# Altium schematic sheet Sch1.SchDoc
size A4; SheetNumber: 4; SheetTotal: 6
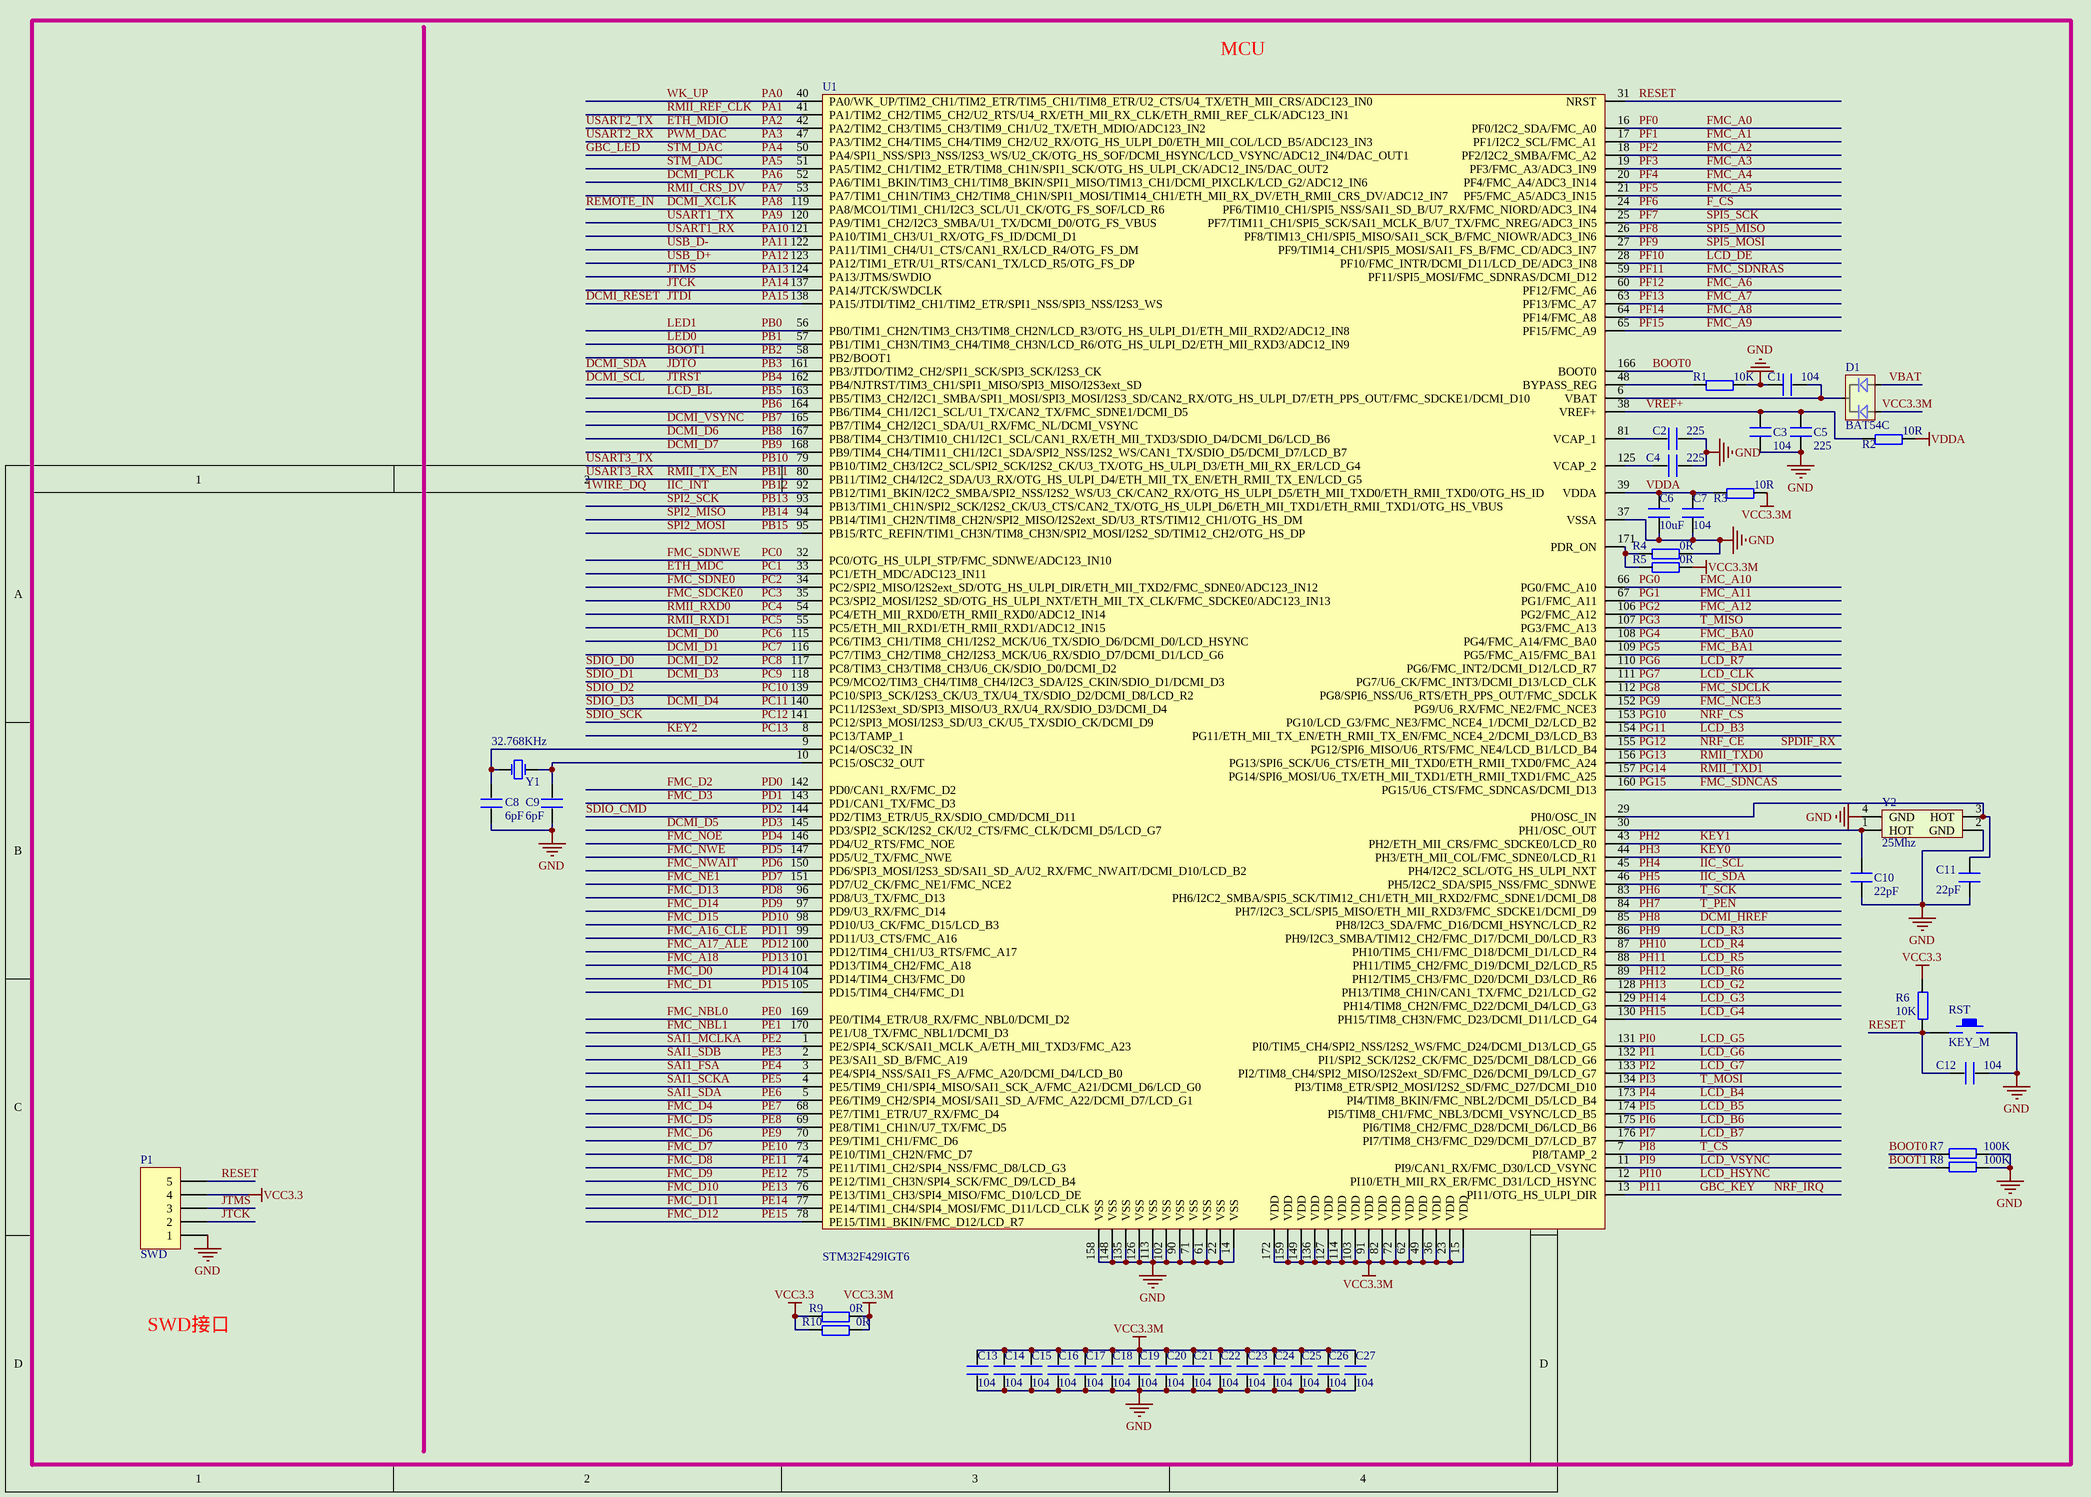
[diagram p0: Sch1.SchDoc]

## Parts
C1  104  [0402]
C2  225  [0402]
C3  104  [0402]
C4  225  [0402]
C5  225  [0402]
C6  10uF  [0603P]
C7  104  [0402]
C8  6pF  [0402]
C9  6pF  [0402]
C10  22pF  [0402]
C11  22pF  [0402]
C12  104  [0402]
C13  104  [0402]
C14  104  [0402]
C15  104  [0402]
C16  104  [0402]
C17  104  [0402]
C18  104  [0402]
C19  104  [0402]
C20  104  [0402]
C21  104  [0402]
C22  104  [0402]
C23  104  [0402]
C24  104  [0402]
C25  104  [0402]
C26  104  [0402]
C27  104  [0402]
D1  BAT54C  [SOT-23]
P1  SWD  [HDR1X5]
R1  10K  [0402]
R2  10R  [0402]
R3  10R  [0402]
R4  0R  [0402]
R5  0R  [0402]
R6  10K  [0402]
R7  100K  [0402]
R8  100K  [0402]
R9  0R  [0402]
R10  0R  [0402]
RST  KEY_M  [KEY_SOP3625]
U1  STM32F429IGT6  [LQFP176]
Y1  32.768KHz  [XTAL3215]
Y2  25Mhz  [XTAL3225]

## Nets
GND: C1.1 C2.2 C3.1 C4.1 C5.1 C6.1 C7.1 C8.1 C9.1 C10.1 C11.1 C12.2 C13.1 C14.1 C15.1 C16.1 C17.1 C18.1 C19.1 C20.1 C21.1 C22.1 C23.1 C24.1 C25.1 C26.1 C27.1 P1.1 R1.2 R4.2 R7.1 R8.1 RST.2 U1.14(VSS) U1.22(VSS) U1.37(VSSA) U1.61(VSS) U1.71(VSS) U1.90(VSS) U1.102(VSS) U1.113(VSS) U1.126(VSS) U1.135(VSS) U1.148(VSS) U1.158(VSS) Y2.2(GND) Y2.4(GND)
VCC3.3: P1.4 R6.2 R9.1 R10.1
VCC3.3M: C13.2 C14.2 C15.2 C16.2 C17.2 C18.2 C19.2 C20.2 C21.2 C22.2 C23.2 C24.2 C25.2 C26.2 C27.2 D1.1 R3.2 R5.2 R9.2 R10.2 U1.15(VDD) U1.23(VDD) U1.36(VDD) U1.49(VDD) U1.62(VDD) U1.72(VDD) U1.82(VDD) U1.91(VDD) U1.103(VDD) U1.114(VDD) U1.127(VDD) U1.136(VDD) U1.149(VDD) U1.159(VDD) U1.172(VDD)
VDDA: C6.2 C7.2 R2.2 R3.1 U1.39(VDDA)
1WIRE_DQ: U1.92(PB12/TIM1_BKIN/I2C2_SMBA/SPI2_NSS/I2S2_WS/U3_CK/CAN2_RX/OTG_HS_ULPI_D5/ETH_MII_TXD0/ETH_RMII_TXD0/OTG_HS_ID)  [also labelled IIC_INT, PB12]
BOOT0: R7.2 U1.166(BOOT0)
BOOT1: R8.2 U1.58(PB2/BOOT1)  [also labelled PB2]
DCMI_D0: U1.115(PC6/TIM3_CH1/TIM8_CH1/I2S2_MCK/U6_TX/SDIO_D6/DCMI_D0/LCD_HSYNC)  [also labelled PC6]
DCMI_D1: U1.116(PC7/TIM3_CH2/TIM8_CH2/I2S3_MCK/U6_RX/SDIO_D7/DCMI_D1/LCD_G6)  [also labelled PC7]
DCMI_D2: U1.117(PC8/TIM3_CH3/TIM8_CH3/U6_CK/SDIO_D0/DCMI_D2)  [also labelled PC8, SDIO_D0]
DCMI_D3: U1.118(PC9/MCO2/TIM3_CH4/TIM8_CH4/I2C3_SDA/I2S_CKIN/SDIO_D1/DCMI_D3)  [also labelled PC9, SDIO_D1]
DCMI_D4: U1.140(PC11/I2S3ext_SD/SPI3_MISO/U3_RX/U4_RX/SDIO_D3/DCMI_D4)  [also labelled PC11, SDIO_D3]
DCMI_D5: U1.145(PD3/SPI2_SCK/I2S2_CK/U2_CTS/FMC_CLK/DCMI_D5/LCD_G7)  [also labelled PD3]
DCMI_D6: U1.167(PB8/TIM4_CH3/TIM10_CH1/I2C1_SCL/CAN1_RX/ETH_MII_TXD3/SDIO_D4/DCMI_D6/LCD_B6)  [also labelled PB8]
DCMI_D7: U1.168(PB9/TIM4_CH4/TIM11_CH1/I2C1_SDA/SPI2_NSS/I2S2_WS/CAN1_TX/SDIO_D5/DCMI_D7/LCD_B7)  [also labelled PB9]
DCMI_HREF: U1.85(PH8/I2C3_SDA/FMC_D16/DCMI_HSYNC/LCD_R2)  [also labelled PH8]
DCMI_PCLK: U1.52(PA6/TIM1_BKIN/TIM3_CH1/TIM8_BKIN/SPI1_MISO/TIM13_CH1/DCMI_PIXCLK/LCD_G2/ADC12_IN6)  [also labelled PA6]
DCMI_RESET: U1.138(PA15/JTDI/TIM2_CH1/TIM2_ETR/SPI1_NSS/SPI3_NSS/I2S3_WS)  [also labelled JTDI, PA15]
DCMI_SCL: U1.162(PB4/NJTRST/TIM3_CH1/SPI1_MISO/SPI3_MISO/I2S3ext_SD)  [also labelled JTRST, PB4]
DCMI_SDA: U1.161(PB3/JTDO/TIM2_CH2/SPI1_SCK/SPI3_SCK/I2S3_CK)  [also labelled JDTO, PB3]
DCMI_VSYNC: U1.165(PB7/TIM4_CH2/I2C1_SDA/U1_RX/FMC_NL/DCMI_VSYNC)  [also labelled PB7]
DCMI_XCLK: U1.119(PA8/MCO1/TIM1_CH1/I2C3_SCL/U1_CK/OTG_FS_SOF/LCD_R6)  [also labelled PA8, REMOTE_IN]
ETH_MDC: U1.33(PC1/ETH_MDC/ADC123_IN11)  [also labelled PC1]
ETH_MDIO: U1.42(PA2/TIM2_CH3/TIM5_CH3/TIM9_CH1/U2_TX/ETH_MDIO/ADC123_IN2)  [also labelled PA2, USART2_TX]
F_CS: U1.24(PF6/TIM10_CH1/SPI5_NSS/SAI1_SD_B/U7_RX/FMC_NIORD/ADC3_IN4)  [also labelled PF6]
FMC_A0: U1.16(PF0/I2C2_SDA/FMC_A0)  [also labelled PF0]
FMC_A1: U1.17(PF1/I2C2_SCL/FMC_A1)  [also labelled PF1]
FMC_A2: U1.18(PF2/I2C2_SMBA/FMC_A2)  [also labelled PF2]
FMC_A3: U1.19(PF3/FMC_A3/ADC3_IN9)  [also labelled PF3]
FMC_A4: U1.20(PF4/FMC_A4/ADC3_IN14)  [also labelled PF4]
FMC_A5: U1.21(PF5/FMC_A5/ADC3_IN15)  [also labelled PF5]
FMC_A6: U1.60(PF12/FMC_A6)  [also labelled PF12]
FMC_A7: U1.63(PF13/FMC_A7)  [also labelled PF13]
FMC_A8: U1.64(PF14/FMC_A8)  [also labelled PF14]
FMC_A9: U1.65(PF15/FMC_A9)  [also labelled PF15]
FMC_A10: U1.66(PG0/FMC_A10)  [also labelled PG0]
FMC_A11: U1.67(PG1/FMC_A11)  [also labelled PG1]
FMC_A12: U1.106(PG2/FMC_A12)  [also labelled PG2]
FMC_A16_CLE: U1.99(PD11/U3_CTS/FMC_A16)  [also labelled PD11]
FMC_A17_ALE: U1.100(PD12/TIM4_CH1/U3_RTS/FMC_A17)  [also labelled PD12]
FMC_A18: U1.101(PD13/TIM4_CH2/FMC_A18)  [also labelled PD13]
FMC_BA0: U1.108(PG4/FMC_A14/FMC_BA0)  [also labelled PG4]
FMC_BA1: U1.109(PG5/FMC_A15/FMC_BA1)  [also labelled PG5]
FMC_D0: U1.104(PD14/TIM4_CH3/FMC_D0)  [also labelled PD14]
FMC_D1: U1.105(PD15/TIM4_CH4/FMC_D1)  [also labelled PD15]
FMC_D2: U1.142(PD0/CAN1_RX/FMC_D2)  [also labelled PD0]
FMC_D3: U1.143(PD1/CAN1_TX/FMC_D3)  [also labelled PD1]
FMC_D4: U1.68(PE7/TIM1_ETR/U7_RX/FMC_D4)  [also labelled PE7]
FMC_D5: U1.69(PE8/TIM1_CH1N/U7_TX/FMC_D5)  [also labelled PE8]
FMC_D6: U1.70(PE9/TIM1_CH1/FMC_D6)  [also labelled PE9]
FMC_D7: U1.73(PE10/TIM1_CH2N/FMC_D7)  [also labelled PE10]
FMC_D8: U1.74(PE11/TIM1_CH2/SPI4_NSS/FMC_D8/LCD_G3)  [also labelled PE11]
FMC_D9: U1.75(PE12/TIM1_CH3N/SPI4_SCK/FMC_D9/LCD_B4)  [also labelled PE12]
FMC_D10: U1.76(PE13/TIM1_CH3/SPI4_MISO/FMC_D10/LCD_DE)  [also labelled PE13]
FMC_D11: U1.77(PE14/TIM1_CH4/SPI4_MOSI/FMC_D11/LCD_CLK)  [also labelled PE14]
FMC_D12: U1.78(PE15/TIM1_BKIN/FMC_D12/LCD_R7)  [also labelled PE15]
FMC_D13: U1.96(PD8/U3_TX/FMC_D13)  [also labelled PD8]
FMC_D14: U1.97(PD9/U3_RX/FMC_D14)  [also labelled PD9]
FMC_D15: U1.98(PD10/U3_CK/FMC_D15/LCD_B3)  [also labelled PD10]
FMC_NBL0: U1.169(PE0/TIM4_ETR/U8_RX/FMC_NBL0/DCMI_D2)  [also labelled PE0]
FMC_NBL1: U1.170(PE1/U8_TX/FMC_NBL1/DCMI_D3)  [also labelled PE1]
FMC_NCE3: U1.152(PG9/U6_RX/FMC_NE2/FMC_NCE3)  [also labelled PG9]
FMC_NE1: U1.151(PD7/U2_CK/FMC_NE1/FMC_NCE2)  [also labelled PD7]
FMC_NOE: U1.146(PD4/U2_RTS/FMC_NOE)  [also labelled PD4]
FMC_NWAIT: U1.150(PD6/SPI3_MOSI/I2S3_SD/SAI1_SD_A/U2_RX/FMC_NWAIT/DCMI_D10/LCD_B2)  [also labelled PD6]
FMC_NWE: U1.147(PD5/U2_TX/FMC_NWE)  [also labelled PD5]
FMC_SDCKE0: U1.35(PC3/SPI2_MOSI/I2S2_SD/OTG_HS_ULPI_NXT/ETH_MII_TX_CLK/FMC_SDCKE0/ADC123_IN13)  [also labelled PC3]
FMC_SDCLK: U1.112(PG8/SPI6_NSS/U6_RTS/ETH_PPS_OUT/FMC_SDCLK)  [also labelled PG8]
FMC_SDNCAS: U1.160(PG15/U6_CTS/FMC_SDNCAS/DCMI_D13)  [also labelled PG15]
FMC_SDNE0: U1.34(PC2/SPI2_MISO/I2S2ext_SD/OTG_HS_ULPI_DIR/ETH_MII_TXD2/FMC_SDNE0/ADC123_IN12)  [also labelled PC2]
FMC_SDNRAS: U1.59(PF11/SPI5_MOSI/FMC_SDNRAS/DCMI_D12)  [also labelled PF11]
FMC_SDNWE: U1.32(PC0/OTG_HS_ULPI_STP/FMC_SDNWE/ADC123_IN10)  [also labelled PC0]
GBC_KEY: U1.13(PI11/OTG_HS_ULPI_DIR)  [also labelled NRF_IRQ, PI11]
GBC_LED: U1.50(PA4/SPI1_NSS/SPI3_NSS/I2S3_WS/U2_CK/OTG_HS_SOF/DCMI_HSYNC/LCD_VSYNC/ADC12_IN4/DAC_OUT1)  [also labelled PA4, STM_DAC]
IIC_SCL: U1.45(PH4/I2C2_SCL/OTG_HS_ULPI_NXT)  [also labelled PH4]
IIC_SDA: U1.46(PH5/I2C2_SDA/SPI5_NSS/FMC_SDNWE)  [also labelled PH5]
JTCK: P1.2 U1.137(PA14/JTCK/SWDCLK)  [also labelled PA14]
JTMS: P1.3 U1.124(PA13/JTMS/SWDIO)  [also labelled PA13]
KEY0: U1.44(PH3/ETH_MII_COL/FMC_SDNE0/LCD_R1)  [also labelled PH3]
KEY1: U1.43(PH2/ETH_MII_CRS/FMC_SDCKE0/LCD_R0)  [also labelled PH2]
KEY2: U1.8(PC13/TAMP_1)  [also labelled PC13]
LCD_B3: U1.154(PG11/ETH_MII_TX_EN/ETH_RMII_TX_EN/FMC_NCE4_2/DCMI_D3/LCD_B3)  [also labelled PG11]
LCD_B4: U1.173(PI4/TIM8_BKIN/FMC_NBL2/DCMI_D5/LCD_B4)  [also labelled PI4]
LCD_B5: U1.174(PI5/TIM8_CH1/FMC_NBL3/DCMI_VSYNC/LCD_B5)  [also labelled PI5]
LCD_B6: U1.175(PI6/TIM8_CH2/FMC_D28/DCMI_D6/LCD_B6)  [also labelled PI6]
LCD_B7: U1.176(PI7/TIM8_CH3/FMC_D29/DCMI_D7/LCD_B7)  [also labelled PI7]
LCD_BL: U1.163(PB5/TIM3_CH2/I2C1_SMBA/SPI1_MOSI/SPI3_MOSI/I2S3_SD/CAN2_RX/OTG_HS_ULPI_D7/ETH_PPS_OUT/FMC_SDCKE1/DCMI_D10)  [also labelled PB5]
LCD_CLK: U1.111(PG7/U6_CK/FMC_INT3/DCMI_D13/LCD_CLK)  [also labelled PG7]
LCD_DE: U1.28(PF10/FMC_INTR/DCMI_D11/LCD_DE/ADC3_IN8)  [also labelled PF10]
LCD_G2: U1.128(PH13/TIM8_CH1N/CAN1_TX/FMC_D21/LCD_G2)  [also labelled PH13]
LCD_G3: U1.129(PH14/TIM8_CH2N/FMC_D22/DCMI_D4/LCD_G3)  [also labelled PH14]
LCD_G4: U1.130(PH15/TIM8_CH3N/FMC_D23/DCMI_D11/LCD_G4)  [also labelled PH15]
LCD_G5: U1.131(PI0/TIM5_CH4/SPI2_NSS/I2S2_WS/FMC_D24/DCMI_D13/LCD_G5)  [also labelled PI0]
LCD_G6: U1.132(PI1/SPI2_SCK/I2S2_CK/FMC_D25/DCMI_D8/LCD_G6)  [also labelled PI1]
LCD_G7: U1.133(PI2/TIM8_CH4/SPI2_MISO/I2S2ext_SD/FMC_D26/DCMI_D9/LCD_G7)  [also labelled PI2]
LCD_HSYNC: U1.12(PI10/ETH_MII_RX_ER/FMC_D31/LCD_HSYNC)  [also labelled PI10]
LCD_R3: U1.86(PH9/I2C3_SMBA/TIM12_CH2/FMC_D17/DCMI_D0/LCD_R3)  [also labelled PH9]
LCD_R4: U1.87(PH10/TIM5_CH1/FMC_D18/DCMI_D1/LCD_R4)  [also labelled PH10]
LCD_R5: U1.88(PH11/TIM5_CH2/FMC_D19/DCMI_D2/LCD_R5)  [also labelled PH11]
LCD_R6: U1.89(PH12/TIM5_CH3/FMC_D20/DCMI_D3/LCD_R6)  [also labelled PH12]
LCD_R7: U1.110(PG6/FMC_INT2/DCMI_D12/LCD_R7)  [also labelled PG6]
LCD_VSYNC: U1.11(PI9/CAN1_RX/FMC_D30/LCD_VSYNC)  [also labelled PI9]
LED0: U1.57(PB1/TIM1_CH3N/TIM3_CH4/TIM8_CH3N/LCD_R6/OTG_HS_ULPI_D2/ETH_MII_RXD3/ADC12_IN9)  [also labelled PB1]
LED1: U1.56(PB0/TIM1_CH2N/TIM3_CH3/TIM8_CH2N/LCD_R3/OTG_HS_ULPI_D1/ETH_MII_RXD2/ADC12_IN8)  [also labelled PB0]
NRF_CE: U1.155(PG12/SPI6_MISO/U6_RTS/FMC_NE4/LCD_B1/LCD_B4)  [also labelled PG12, SPDIF_RX]
NRF_CS: U1.153(PG10/LCD_G3/FMC_NE3/FMC_NCE4_1/DCMI_D2/LCD_B2)  [also labelled PG10]
PA0: U1.40(PA0/WK_UP/TIM2_CH1/TIM2_ETR/TIM5_CH1/TIM8_ETR/U2_CTS/U4_TX/ETH_MII_CRS/ADC123_IN0)  [also labelled WK_UP]
PA1: U1.41(PA1/TIM2_CH2/TIM5_CH2/U2_RTS/U4_RX/ETH_MII_RX_CLK/ETH_RMII_REF_CLK/ADC123_IN1)  [also labelled RMII_REF_CLK]
PA3: U1.47(PA3/TIM2_CH4/TIM5_CH4/TIM9_CH2/U2_RX/OTG_HS_ULPI_D0/ETH_MII_COL/LCD_B5/ADC123_IN3)  [also labelled PWM_DAC, USART2_RX]
PA5: U1.51(PA5/TIM2_CH1/TIM2_ETR/TIM8_CH1N/SPI1_SCK/OTG_HS_ULPI_CK/ADC12_IN5/DAC_OUT2)  [also labelled STM_ADC]
PA7: U1.53(PA7/TIM1_CH1N/TIM3_CH2/TIM8_CH1N/SPI1_MOSI/TIM14_CH1/ETH_MII_RX_DV/ETH_RMII_CRS_DV/ADC12_IN7)  [also labelled RMII_CRS_DV]
PA9: U1.120(PA9/TIM1_CH2/I2C3_SMBA/U1_TX/DCMI_D0/OTG_FS_VBUS)  [also labelled USART1_TX]
PA10: U1.121(PA10/TIM1_CH3/U1_RX/OTG_FS_ID/DCMI_D1)  [also labelled USART1_RX]
PA11: U1.122(PA11/TIM1_CH4/U1_CTS/CAN1_RX/LCD_R4/OTG_FS_DM)  [also labelled USB_D-]
PA12: U1.123(PA12/TIM1_ETR/U1_RTS/CAN1_TX/LCD_R5/OTG_FS_DP)  [also labelled USB_D+]
PB6: U1.164(PB6/TIM4_CH1/I2C1_SCL/U1_TX/CAN2_TX/FMC_SDNE1/DCMI_D5)
PB10: U1.79(PB10/TIM2_CH3/I2C2_SCL/SPI2_SCK/I2S2_CK/U3_TX/OTG_HS_ULPI_D3/ETH_MII_RX_ER/LCD_G4)  [also labelled USART3_TX]
PB11: U1.80(PB11/TIM2_CH4/I2C2_SDA/U3_RX/OTG_HS_ULPI_D4/ETH_MII_TX_EN/ETH_RMII_TX_EN/LCD_G5)  [also labelled RMII_TX_EN, USART3_RX]
PB13: U1.93(PB13/TIM1_CH1N/SPI2_SCK/I2S2_CK/U3_CTS/CAN2_TX/OTG_HS_ULPI_D6/ETH_MII_TXD1/ETH_RMII_TXD1/OTG_HS_VBUS)  [also labelled SPI2_SCK]
PB14: U1.94(PB14/TIM1_CH2N/TIM8_CH2N/SPI2_MISO/I2S2ext_SD/U3_RTS/TIM12_CH1/OTG_HS_DM)  [also labelled SPI2_MISO]
PB15: U1.95(PB15/RTC_REFIN/TIM1_CH3N/TIM8_CH3N/SPI2_MOSI/I2S2_SD/TIM12_CH2/OTG_HS_DP)  [also labelled SPI2_MOSI]
PC4: U1.54(PC4/ETH_MII_RXD0/ETH_RMII_RXD0/ADC12_IN14)  [also labelled RMII_RXD0]
PC5: U1.55(PC5/ETH_MII_RXD1/ETH_RMII_RXD1/ADC12_IN15)  [also labelled RMII_RXD1]
PC10: U1.139(PC10/SPI3_SCK/I2S3_CK/U3_TX/U4_TX/SDIO_D2/DCMI_D8/LCD_R2)  [also labelled SDIO_D2]
PC12: U1.141(PC12/SPI3_MOSI/I2S3_SD/U3_CK/U5_TX/SDIO_CK/DCMI_D9)  [also labelled SDIO_SCK]
PD2: U1.144(PD2/TIM3_ETR/U5_RX/SDIO_CMD/DCMI_D11)  [also labelled SDIO_CMD]
PE2: U1.1(PE2/SPI4_SCK/SAI1_MCLK_A/ETH_MII_TXD3/FMC_A23)  [also labelled SAI1_MCLKA]
PE3: U1.2(PE3/SAI1_SD_B/FMC_A19)  [also labelled SAI1_SDB]
PE4: U1.3(PE4/SPI4_NSS/SAI1_FS_A/FMC_A20/DCMI_D4/LCD_B0)  [also labelled SAI1_FSA]
PE5: U1.4(PE5/TIM9_CH1/SPI4_MISO/SAI1_SCK_A/FMC_A21/DCMI_D6/LCD_G0)  [also labelled SAI1_SCKA]
PE6: U1.5(PE6/TIM9_CH2/SPI4_MOSI/SAI1_SD_A/FMC_A22/DCMI_D7/LCD_G1)  [also labelled SAI1_SDA]
PF7: U1.25(PF7/TIM11_CH1/SPI5_SCK/SAI1_MCLK_B/U7_TX/FMC_NREG/ADC3_IN5)  [also labelled SPI5_SCK]
PF8: U1.26(PF8/TIM13_CH1/SPI5_MISO/SAI1_SCK_B/FMC_NIOWR/ADC3_IN6)  [also labelled SPI5_MISO]
PF9: U1.27(PF9/TIM14_CH1/SPI5_MOSI/SAI1_FS_B/FMC_CD/ADC3_IN7)  [also labelled SPI5_MOSI]
PG3: U1.107(PG3/FMC_A13)  [also labelled T_MISO]
PG13: U1.156(PG13/SPI6_SCK/U6_CTS/ETH_MII_TXD0/ETH_RMII_TXD0/FMC_A24)  [also labelled RMII_TXD0]
PG14: U1.157(PG14/SPI6_MOSI/U6_TX/ETH_MII_TXD1/ETH_RMII_TXD1/FMC_A25)  [also labelled RMII_TXD1]
PH6: U1.83(PH6/I2C2_SMBA/SPI5_SCK/TIM12_CH1/ETH_MII_RXD2/FMC_SDNE1/DCMI_D8)  [also labelled T_SCK]
PH7: U1.84(PH7/I2C3_SCL/SPI5_MISO/ETH_MII_RXD3/FMC_SDCKE1/DCMI_D9)  [also labelled T_PEN]
PI3: U1.134(PI3/TIM8_ETR/SPI2_MOSI/I2S2_SD/FMC_D27/DCMI_D10)  [also labelled T_MOSI]
PI8: U1.7(PI8/TAMP_2)  [also labelled T_CS]
RESET: C12.1 P1.5 R6.1 RST.1 U1.31(NRST)
VBAT: D1.2
VREF+: C3.2 C5.2 R2.1 U1.38(VREF+)
NetC1_2: C1.2 D1.3 U1.6(VBAT)
NetC2_1: C2.1 U1.81(VCAP_1)
NetC4_2: C4.2 U1.125(VCAP_2)
NetC8_2: C8.2 U1.9(PC14/OSC32_IN) Y1.1(OSC1)
NetC9_2: C9.2 U1.10(PC15/OSC32_OUT) Y1.2(OSC2)
NetC10_2: C10.2 U1.30(PH1/OSC_OUT) Y2.1(HOT)
NetC11_2: C11.2 U1.29(PH0/OSC_IN) Y2.3(HOT)
NetR1_1: R1.1 U1.48(BYPASS_REG)
NetR4_1: R4.1 R5.1 U1.171(PDR_ON)

## Notes on the sheet
- (near U1) MCU
- SWD接口

## Library data of the parts
C1-C27 = C
D1 = BAT54C: 双肖特基二极管
P1 = Header 5: Header, 5-Pin; LatestRevisionDate: 17-Jul-2002; LatestRevisionNote: Re-released for DXP Platform.; Publisher: Altium Limited
R1-R10 = R
Y1 = XTAL: 普通晶振; Published: 8-Jun-2000; LatestRevisionDate: 17-Jul-2002; LatestRevisionNote: Re-released for DXP Platform.; Publisher: Altium Limited
Y2 = XTAL_3225: 3225贴片无源晶振